# EAGLE design Alat pendeteksi kebisingan (EAGLE 9.6.2)
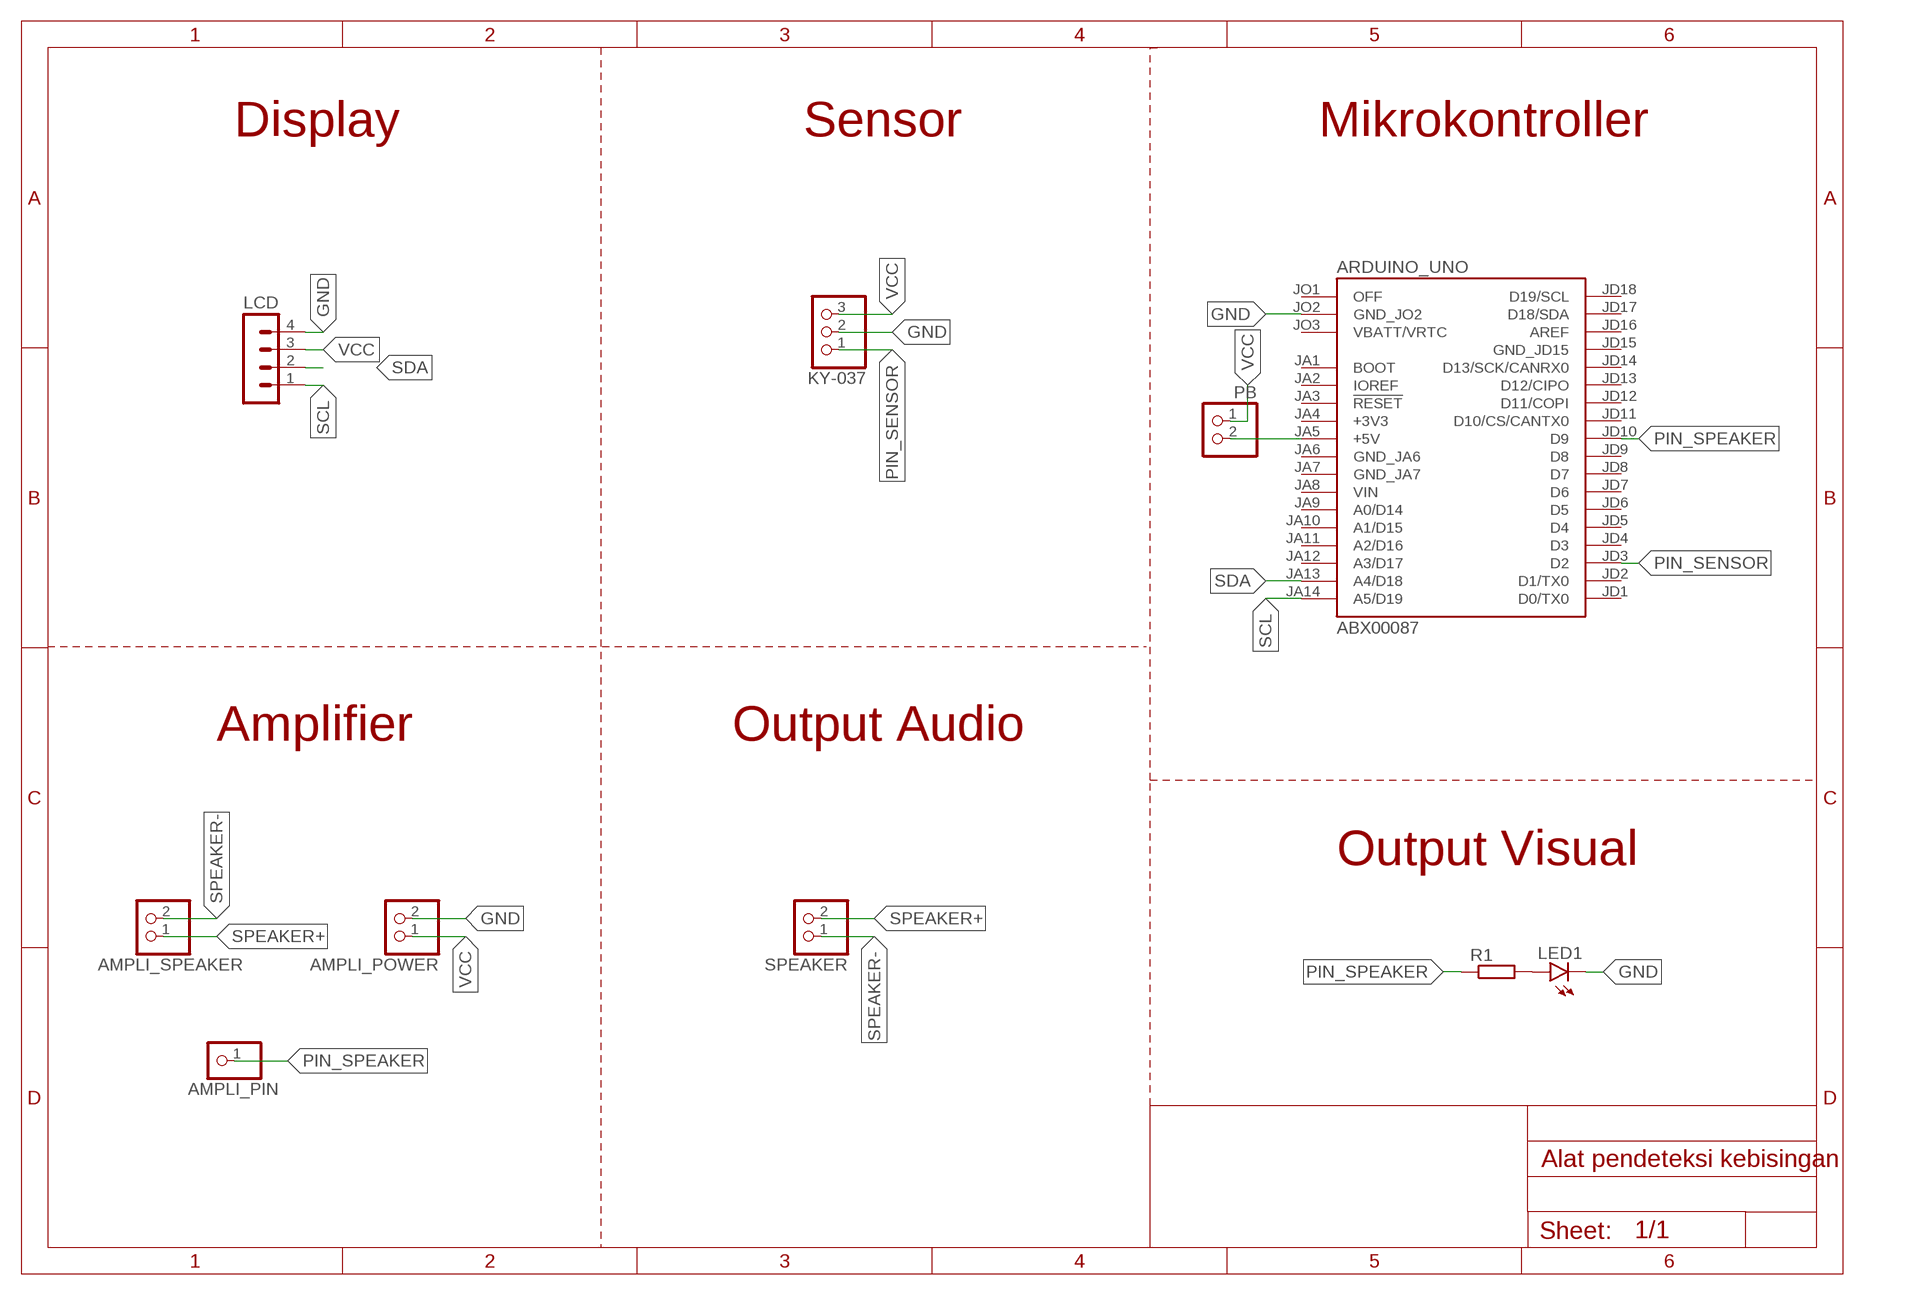
[diagram p0: schematic, sheet 1]

## Parts
AMPLI_PIN  PINHD-1X1  [1X01]
AMPLI_POWER  PINHD-1X2  [1X02]
AMPLI_SPEAKER  PINHD-1X2  [1X02]
ARDUINO_UNO  ABX00087  [MODULE_ABX00087]
KY-037  PINHD-1X3  [1X03]
LCD  MA04-1  [MA04-1]
LED1  LED3MM  [LED3MM]
PB  PINHD-1X2  [1X02]
R1  R-EU_0207/10  [0207/10]
SPEAKER  PINHD-1X2  [1X02]

## Nets
GND: AMPLI_POWER.2 ARDUINO_UNO.JO2(GND_JO2) KY-037.2 LCD.4 LED1.K(C)
N$1: ARDUINO_UNO.JA5(+5V) PB.2
N$2: LED1.A R1.2
PIN_SENSOR: ARDUINO_UNO.JD3(D2) KY-037.1
PIN_SPEAKER: AMPLI_PIN.1 ARDUINO_UNO.JD10(D9) R1.1
SCL: ARDUINO_UNO.JA14(A5/D19) LCD.1
SDA: ARDUINO_UNO.JA13(A4/D18) LCD.2
SPEAKER+: AMPLI_SPEAKER.1 SPEAKER.2
SPEAKER-: AMPLI_SPEAKER.2 SPEAKER.1
VCC: AMPLI_POWER.1 KY-037.3 LCD.3 PB.1
Unconnected: ARDUINO_UNO.JA1(BOOT) ARDUINO_UNO.JA2(IOREF) ARDUINO_UNO.JA3(!RESET) ARDUINO_UNO.JA9(A0/D14) ARDUINO_UNO.JA10(A1/D15) ARDUINO_UNO.JA11(A2/D16) ARDUINO_UNO.JA12(A3/D17) ARDUINO_UNO.JD1(D0/TX0) ARDUINO_UNO.JD2(D1/TX0) ARDUINO_UNO.JD4(D3) ARDUINO_UNO.JD5(D4) ARDUINO_UNO.JD6(D5) ARDUINO_UNO.JD7(D6) ARDUINO_UNO.JD8(D7) ARDUINO_UNO.JD9(D8) ARDUINO_UNO.JD11(D10/CS/CANTX0) ARDUINO_UNO.JD12(D11/COPI) ARDUINO_UNO.JD13(D12/CIPO) ARDUINO_UNO.JD14(D13/SCK/CANRX0) ARDUINO_UNO.JD16(AREF) ARDUINO_UNO.JD17(D18/SDA) ARDUINO_UNO.JD18(D19/SCL) ARDUINO_UNO.JO1(OFF)

## Notes on the sheet
- Display | Sensor | Mikrokontroller
- Amplifier | Output Audio
- Output Visual

## Power pins joined to a net without a drawn wire
+3V3: ARDUINO_UNO.JA4(+3V3)
GND_JA6: ARDUINO_UNO.JA6(GND_JA6)
GND_JA7: ARDUINO_UNO.JA7(GND_JA7)
GND_JD15: ARDUINO_UNO.JD15(GND_JD15)
P: ARDUINO_UNO.JA8(VIN)
VBATT/VRTC: ARDUINO_UNO.JO3(VBATT/VRTC)

## Library data of the parts
AMPLI_PIN = pinhead:PINHD-1X1: PIN HEADER
AMPLI_POWER AMPLI_SPEAKER PB SPEAKER = pinhead:PINHD-1X2: PIN HEADER
ARDUINO_UNO = ABX00087:ABX00087: Check availability <https://pricing.snapeda.com/parts/ABX00087/Arduino/view-part?ref=eda>; AVAILABILITY: In Stock; CHECK_PRICES: https://www.snapeda.com/parts/ABX00087/Arduino/view-part/?ref=eda; DESCRIPTION: Arduino Uno Rev4 Wifi Rohs Compliant: Yes |Arduino ABX00087; MF: Arduino; MP: ABX00087; PACKAGE: None; PRICE: None; PURCHASE-URL: https://www.snapeda.com/api/url_track_click_mouser/?unipart_id=13853140&manufacturer=Arduino&part_name=ABX00087&search_term=arduino uno; SNAPEDA_LINK: https://www.snapeda.com/parts/ABX00087/Arduino/view-part/?ref=snap
KY-037 = pinhead:PINHD-1X3: PIN HEADER
LCD = con-lstb:MA04-1: PIN HEADER; OC_FARNELL: unknown; OC_NEWARK: unknown
LED1 = led:LED: LED OSRAM: - CHIPLED LG R971, LG N971, LY N971, LG Q971, LY Q971, LO R971, LY R971 LH N974, LH R974 LS Q976, LO Q976, LY Q976 LO Q996 - Hyper CHIPLED LW Q18S LB Q993, LB Q99A, LB R99A - SideLED LS A670, LO A670, LY A670, LG A670, LP A670 LB A673, LV A673, LT A673, LW A673 LH A674 LY A675 LS A676, LA A676, LO A676, LY A676, LW A676 LS A679, LY A679, LG A679 - Hyper Micro SIDELED® LS Y876, LA Y876, LO Y876, LY Y876 LT Y87S - SmartLED LW L88C, LW L88S LB L89C, LB L89S, LG L890 LS L89K, LO L89K, LY L89K LS L896, LA L896, LO L896, LY L896 - TOPLED LS T670, LO T670, LY T670, LG T670, LP T670 LSG T670, LSP T670, LSY T670, LOP T670, LYG T670 LG T671, LOG T671, LSG T671 LB T673, LV T673, LT T673, LW T673 LH T674 LS T676, LA T676, LO T676, LY T676, LB T676, LH T676, LSB T676, LW T676 LB T67C, LV T67C, LT T67C, LS T67K, LO T67K, LY T67K, LW E67C LS E67B, LA E67B, LO E67B, LY E67B, LB E67C, LV E67C, LT E67C LW T67C LS T679, LY T679, LG T679 LS T770, LO T770, LY T770, LG T770, LP T770 LB T773, LV T773, LT T773, LW T773 LH T774 LS E675, LA E675, LY E675, LS T675 LS T776, LA T776, LO T776, LY T776, LB T776 LHGB T686 LT T68C, LB T68C - Hyper Mini TOPLED® LB M676 - Mini TOPLED Santana® LG M470 LS M47K, LO M47K, LY M47K Source: http://www.osram.convergy.de LUXEON: - LUMILED® LXK2-PW12-R00, LXK2-PW12-S00, LXK2-PW14-U00, LXK2-PW14-V00 LXK2-PM12-R00, LXK2-PM12-S00, LXK2-PM14-U00 LXK2-PE12-Q00, LXK2-PE12-R00, LXK2-PE12-S00, LXK2-PE14-T00, LXK2-PE14-U00 LXK2-PB12-K00, LXK2-PB12-L00, LXK2-PB12-M00, LXK2-PB14-N00, LXK2-PB14-P00, LXK2-PB14-Q00 LXK2-PR12-L00, LXK2-PR12-M00, LXK2-PR14-Q00, LXK2-PR14-R00 LXK2-PD12-Q00, LXK2-PD12-R00, LXK2-PD12-S00 LXK2-PH12-R00, LXK2-PH12-S00 LXK2-PL12-P00, LXK2-PL12-Q00, LXK2-PL12-R00 Source: www.luxeon.com KINGBRIGHT: KA-3528ASYC Source: www.kingbright.com
R1 = rcl:R-EU_: RESISTOR, European symbol; SPICEPREFIX: R

## Board
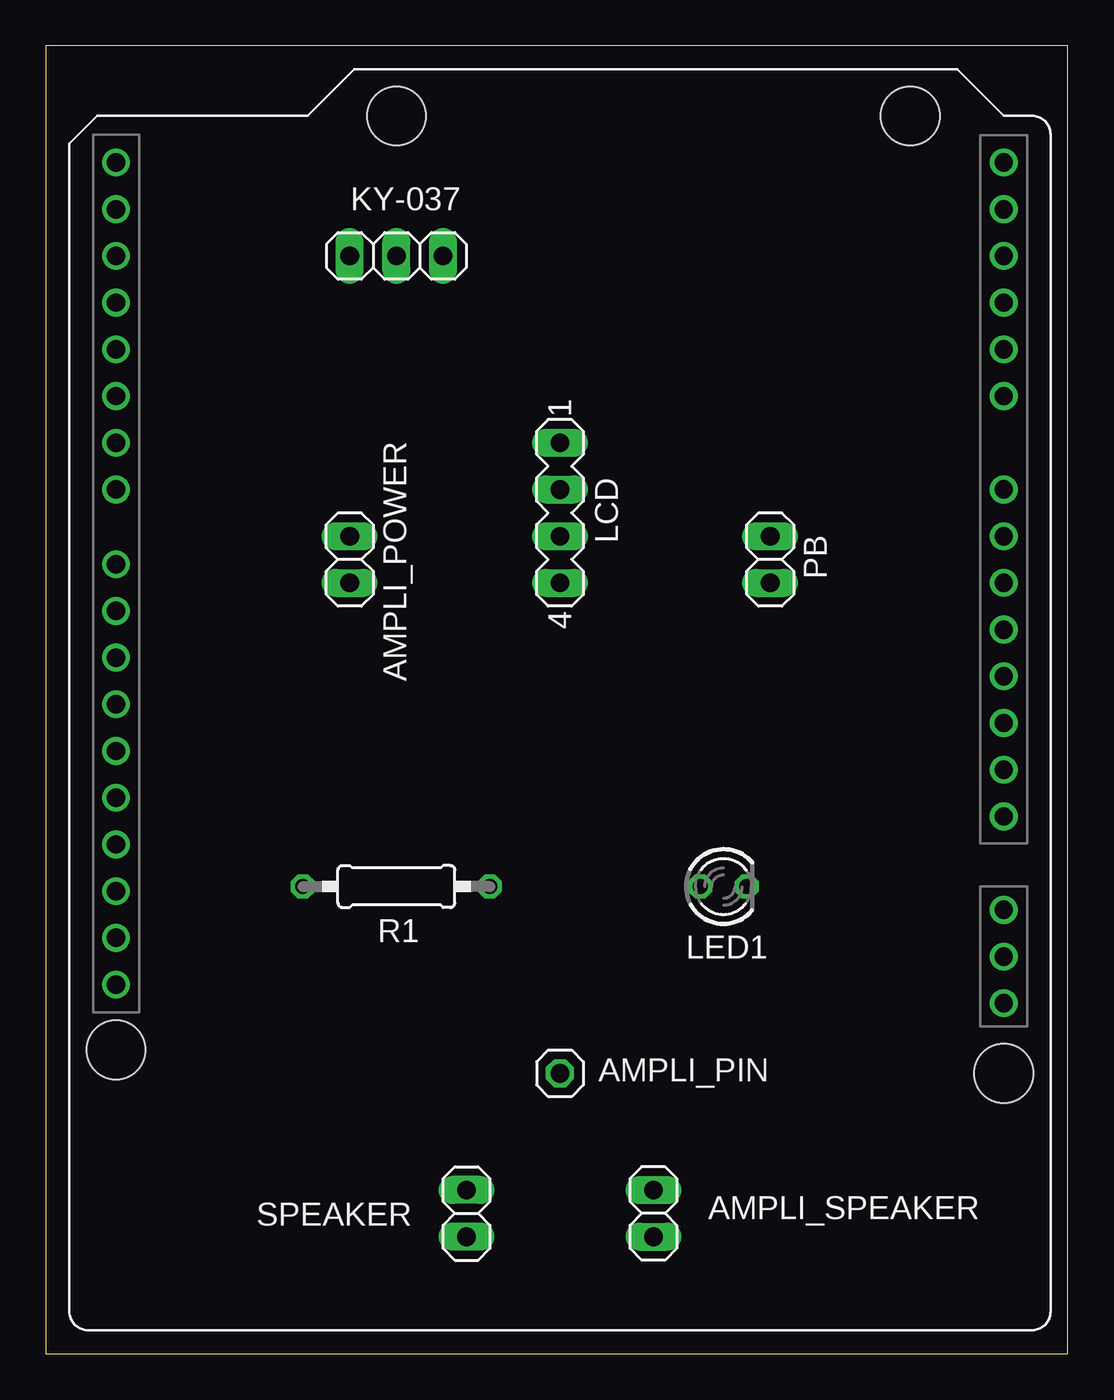
[diagram p1: board, top side]
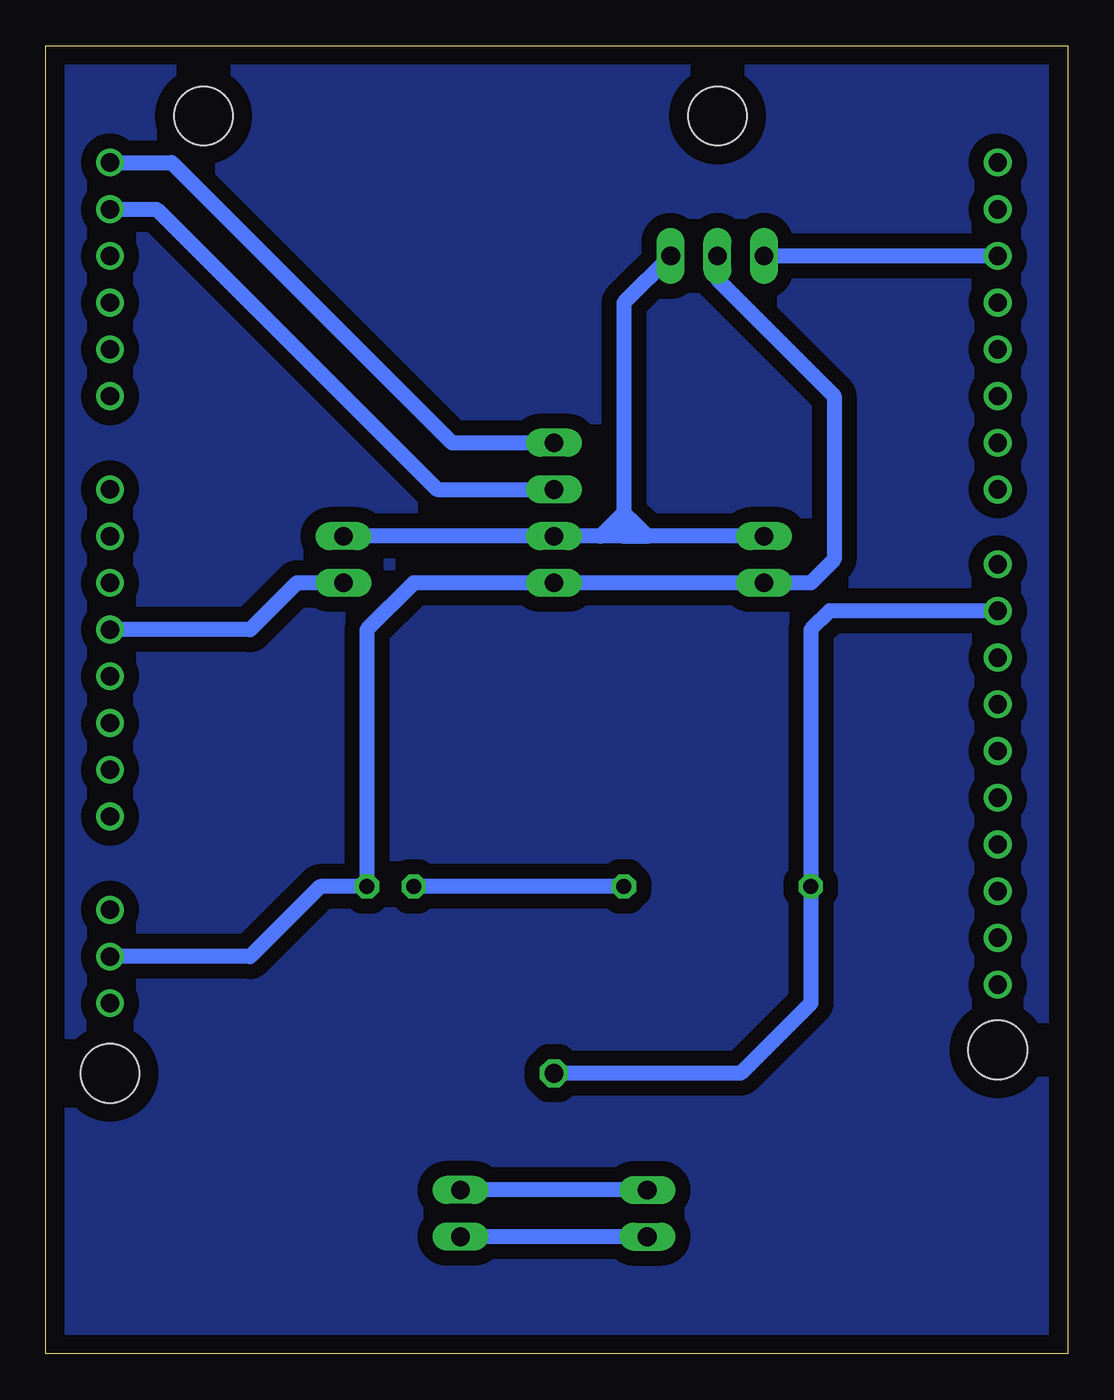
[diagram p2: board, bottom side, seen from below]

Size 55.55 x 71.11 mm. Coordinates in mm from the lower left corner, seen from the top.
Outline: 0,0 55.55,0 55.55,71.11 0,71.11 0,0
Copper layers (1*16): Top 0.035mm / dielectric 1.5mm / Bottom 0.035mm
Design rules "default": minimum track width 6mil, minimum drill 0.35mm, track to track 6mil, track to pad 6mil, pad to pad 6mil, via to via 6mil, smd to smd 6mil, copper to edge 40mil, drill to drill 6mil, minimum pad ring 10mil, minimum via ring 8mil, stop-mask expansion 4mil, vias tented up to drill 0mil, thermal gap 10mil

### Footprints (pad centres in the part's own frame; a part is rotated, then mirrored left to right if it is on the bottom)
1X01 = drill 1.016 octagon: 1 0,0
1X02 = drill 1.016 long: 1 -1.27,0; 2 1.27,0
MODULE_ABX00087 = drill 1: JA1 -6.35,-24.13; JA2 -3.81,-24.13; JA3 -1.27,-24.13; JA4 1.27,-24.13; JA5 3.81,-24.13; JA6 6.35,-24.13; JA7 8.89,-24.13; JA8 11.43,-24.13; JA9 16.51,-24.13; JA10 19.05,-24.13; JA11 21.59,-24.13; JA12 24.13,-24.13; JA13 26.67,-24.13; JA14 29.21,-24.13; JD1 29.21,24.13; JD2 26.67,24.13; JD3 24.13,24.13; JD4 21.59,24.13; JD5 19.05,24.13; JD6 16.51,24.13; JD7 13.97,24.13; JD8 11.43,24.13; JD9 7.366,24.13; JD10 4.826,24.13; JD11 2.286,24.13; JD12 -0.254,24.13; JD13 -2.794,24.13; JD14 -5.334,24.13; JD15 -7.874,24.13; JD16 -10.414,24.13; JD17 -12.954,24.13; JD18 -15.494,24.13; JO1 -16.51,-24.13; JO2 -13.97,-24.13; JO3 -11.43,-24.13 | hole 3.2: -20.32,-24.13; -19.05,24.13; 31.75,8.89; 31.75,-19.05
1X03 = drill 1.016 long: 1 -2.54,0; 2 0,0; 3 2.54,0
MA04-1 = drill 1.016 long: 1 -3.81,0; 2 -1.27,0; 3 1.27,0; 4 3.81,0
LED3MM = drill 0.813 octagon: A -1.27,0; K 1.27,0
0207/10 = drill 0.813 octagon: 1 -5.08,0; 2 5.08,0

### Placement (x,y rotation side)
AMPLI_PIN  27.94,15.24 0 top
AMPLI_POWER  16.51,43.18 270 top
AMPLI_SPEAKER  33.02,7.62 270 top
ARDUINO_UNO  27.94,35.56 90 top
KY-037  19.05,59.69 0 top
LCD  27.94,45.72 270 top
LED1  36.83,25.4 0 top
PB  39.37,43.18 270 top
R1  19.05,25.4 0 top
SPEAKER  22.86,7.62 90 top

### Tracks (layer width: path | path; a pad name or v marks a point on that pad's centre or on a via)
GND
  Bottom 0.813: KY-037.2 19.05,58.42 12.7,52.07 12.7,43.18 13.97,41.91 AMPLI_POWER.2 LCD.4 35.56,41.91 38.1,39.37 LED1.K 40.64,25.4 44.45,21.59 ARDUINO_UNO.JO2
N$1
  Bottom 0.813: PB.2 41.91,41.91 44.45,39.37 ARDUINO_UNO.JA5
N$2
  Bottom 0.813: R1.2 LED1.A
N$3
  pour Bottom (isolate 0.813): 0,71.12 0,0 55.88,0 55.88,71.12
PIN_SENSOR
  Bottom 0.813: ARDUINO_UNO.JD3 KY-037.1
PIN_SPEAKER
  Bottom 0.813: ARDUINO_UNO.JD10 12.95,40.39 13.97,39.37 R1.1 13.97,19.05 17.78,15.24 AMPLI_PIN.1
SCL
  Bottom 0.813: ARDUINO_UNO.JA14 48.72,64.77 33.48,49.53 LCD.1
SDA
  Bottom 0.813: ARDUINO_UNO.JA13 49.53,62.23 34.29,46.99 LCD.2
SPEAKER+
  Bottom 0.813: SPEAKER.2 AMPLI_SPEAKER.1
SPEAKER-
  Bottom 0.813: SPEAKER.1 AMPLI_SPEAKER.2
VCC
  Bottom 0.813: KY-037.3 24.13,57.15 24.13,48.26 24.13,45.72 | 25.4,44.45 24.77,45.09 | 24.77,45.09 24.13,45.72 | AMPLI_POWER.1 22.86,44.45 | 24.13,44.45 22.86,44.45 | 25.4,44.45 LCD.3 PB.1 | 23.5,45.09 24.13,45.72 | 23.5,45.09 22.86,44.45 | 23.5,45.09 24.13,44.45 | 24.13,44.45 25.4,44.45 | 24.13,44.45 24.77,45.09 | 24.13,45.72 24.13,44.45